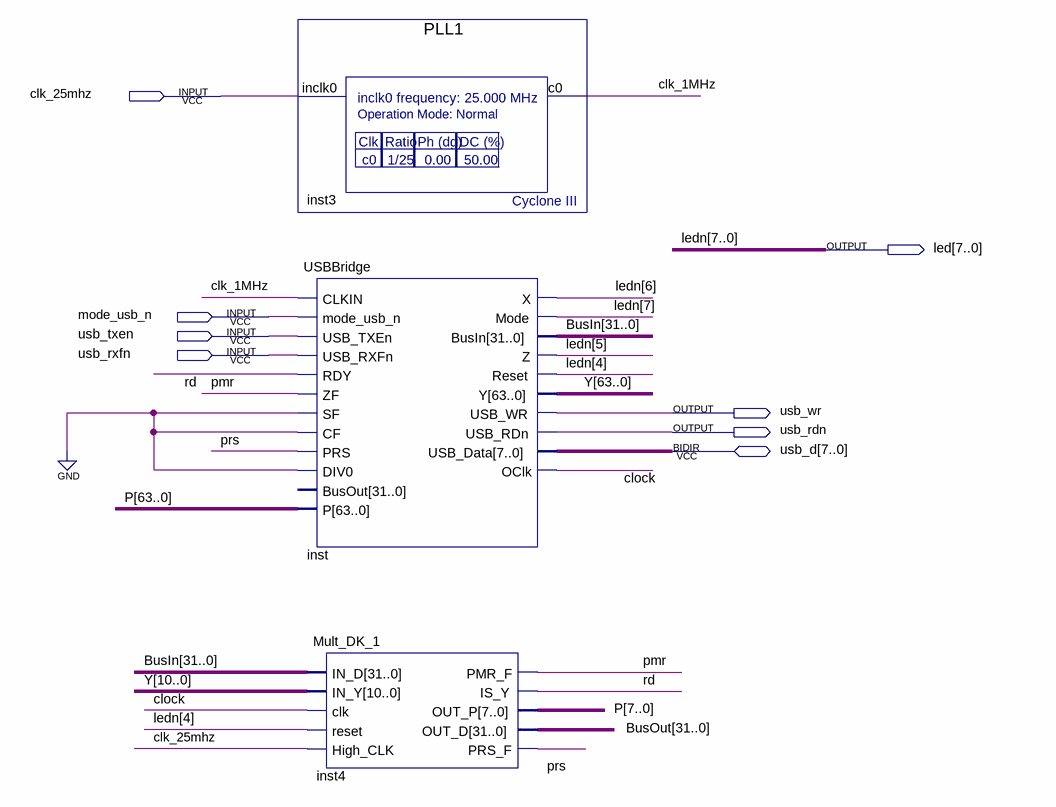
[diagram p0: schematic sheet]
// Quartus schematic Digital_Device_1.bdf as structural Verilog: 3 symbols, 8 pins
module Digital_Device_1 (
  input  clk_25mhz,
  input  mode_usb_n,
  input  usb_txen,
  input  usb_rxfn,
  inout  [7:0] usb_d,
  output [7:0] led,
  output usb_wr,
  output usb_rdn
);

  wire clk_1MHz, clock, pmr, prs, rd;
  wire [31:0] BusIn, BusOut;
  wire [63:0] P, Y;

  PLL1 inst3 (.inclk0(clk_25mhz), .c0(clk_1MHz));
  USBBridge inst (
    .CLKIN(clk_1MHz), .mode_usb_n(mode_usb_n), .USB_TXEn(usb_txen), .USB_RXFn(usb_rxfn), .RDY(rd), .ZF(pmr),
    .SF(1'b0), .CF(1'b0), .PRS(prs), .DIV0(1'b0), .P(P), .X(led[6]), .Mode(led[7]), .BusIn(BusIn),
    .Z(led[5]), .Reset(led[4]), .Y(Y), .USB_WR(usb_wr), .USB_RDn(usb_rdn), .OClk(clock), .USB_Data(usb_d));  // open: BusOut
  Mult_DK_1 inst4 (
    .IN_D(BusIn), .IN_Y(Y[10:0]), .clk(clock), .reset(led[4]), .High_CLK(clk_25mhz), .PMR_F(pmr), .IS_Y(rd),
    .OUT_P(P[7:0]), .OUT_D(BusOut), .PRS_F(prs));

  // Other names for the same wires on the sheet: ledn[7:0] = led
endmodule
